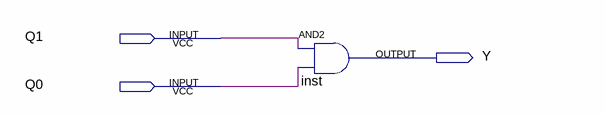
[diagram p0: schematic sheet]
// Quartus schematic Y.bdf as structural Verilog: 1 symbols, 3 pins
module Y (
  input  Q1,
  input  Q0,
  output Y
);

  and inst (Y, Q1, Q0);
endmodule
